# Altium project CM4 IO_V1.10.PrjPcb (part 2 of 5)

## Sheet 07 Audio SPK.SchDoc: CM4 IO
size 297 x 209 mm; Page Create Date: March  8, 1995; Page Number: 7; Page Size: A4; Comment: radxa_1010; Page Count: 19; RevCode: V1.10; Doc: 07 Audio SPK; DsnPath: D:\WMS\黄工\[RC126]CM4_IO_V1.10\[RC126]_V1.10\CM4 IO_V1.10.DSN; SchematicName: CM4 IO V1.10; PageName: 07 Audio SPK; PageSize: A4; TopSchematic: True
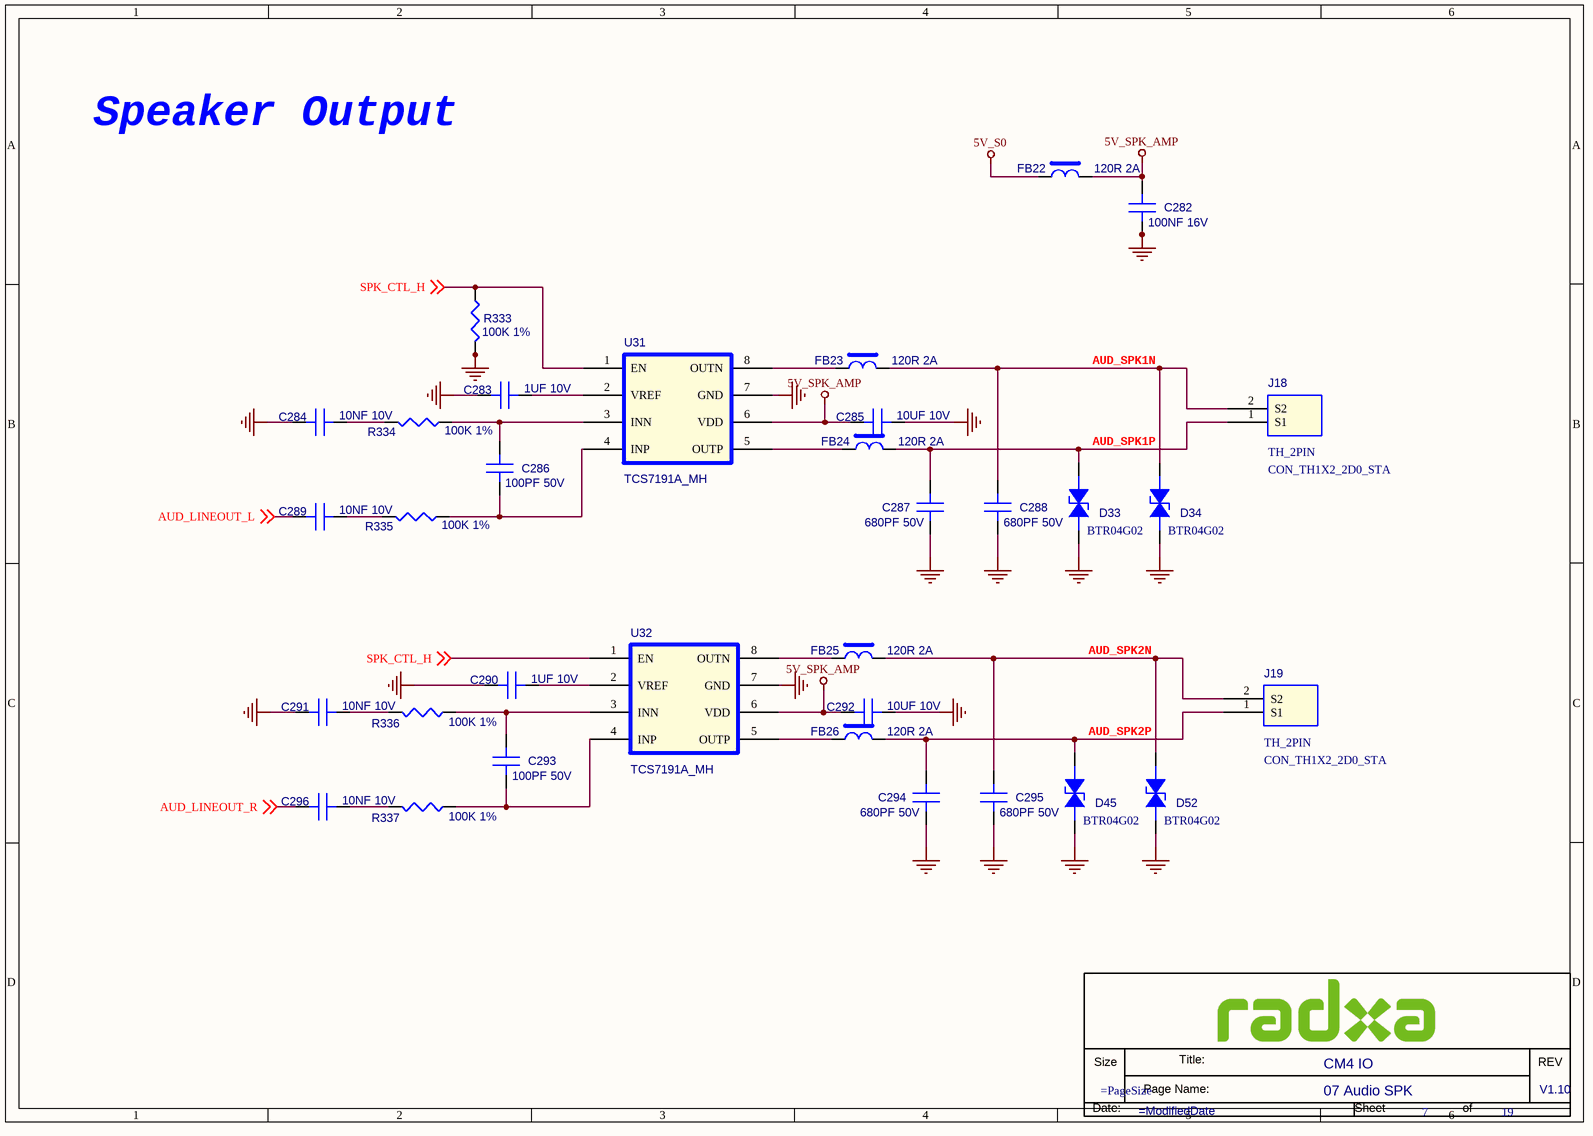
[diagram p5: 07 Audio SPK.SchDoc]

### Parts
(Parts that share a designator on the sheet are numbered #1, #2 ... from top to bottom, then left to right.)
*#6  Doc: 07 Audio SPK  RevCode: V1.10  Title: CM4 IO  Page Number: 7  Page Count: 19  (hidden comment: radxa_1010)  (graphical)
C282  100NF 16V  [C0201]
C283  1UF 10V  [C0201]
C284  10NF 10V  [C0201]
C285  10UF 10V  [C0603]
C286  100PF 50V  [C0201]
C287  680PF 50V  [C0201]
C288  680PF 50V  [C0201]
C289  10NF 10V  [C0201]
C290  1UF 10V  [C0201]
C291  10NF 10V  [C0201]
C292  10UF 10V  [C0603]
C293  100PF 50V  [C0201]
C294  680PF 50V  [C0201]
C295  680PF 50V  [C0201]
C296  10NF 10V  [C0201]
D33  BTR04G02  [DFN1006-2L]
D34  BTR04G02  [DFN1006-2L]
D45  BTR04G02  [DFN1006-2L]
D52  BTR04G02  [DFN1006-2L]
FB22  120R 2A  [FB0402]
FB23  120R 2A  [FB0402]
FB24  120R 2A  [FB0402]
FB25  120R 2A  [FB0402]
FB26  120R 2A  [FB0402]
J18  TH_2PIN  PCB Footprint: CON_TH1X2_2D0_STA  [CON_TH1X2_2D54_STA]
J19  TH_2PIN  PCB Footprint: CON_TH1X2_2D0_STA  [CON_TH1X2_2D54_STA]
R333  100K 1%  [R0402]
R334  100K 1%  [R0402]
R335  100K 1%  [R0402]
R336  100K 1%  [R0402]
R337  100K 1%  [R0402]
U31  TCS7191A_MH  [MSOP8_0D65_5D0]
U32  TCS7191A_MH  [MSOP8_0D65_5D0]

### Nets
5V_S0: FB22.1
5V_SPK_AMP: C282.1(A) C285.1(A) C292.1(A) FB22.2 U31.6(VDD) U32.6(VDD)
GND: C282.2(B) C283.1(A) C284.1(A) C285.2(B) C287.2(B) C288.2(B) C290.1(A) C291.1(A) C292.2(B) C294.2(B) C295.2(B) D33.1(ANODE) D34.1(ANODE) D45.1(ANODE) D52.1(ANODE) R333.2 U31.7(GND) U32.7(GND)
AUD_LINEOUT_L: C289.1(A) ; off-sheet AUD_LINEOUT_L
AUD_LINEOUT_R: C296.1(A) ; off-sheet AUD_LINEOUT_R
AUD_SPK1N: C288.1(A) D34.2(CATHODE) FB23.2 J18.2(S2)
AUD_SPK1P: C287.1(A) D33.2(CATHODE) FB24.2 J18.1(S1)
AUD_SPK2N: C295.1(A) D52.2(CATHODE) FB25.2 J19.2(S2)
AUD_SPK2P: C294.1(A) D45.2(CATHODE) FB26.2 J19.1(S1)
SPK_CTL_H: R333.1 U31.1(EN) U32.1(EN) ; off-sheet SPK_CTL_H
NetC283_2: C283.2(B) U31.2(VREF)
NetC284_2: C284.2(B) R334.1
NetC286_1: C286.1(A) R334.2 U31.3(INN)
NetC286_2: C286.2(B) R335.2 U31.4(INP)
NetC289_2: C289.2(B) R335.1
NetC290_2: C290.2(B) U32.2(VREF)
NetC291_2: C291.2(B) R336.1
NetC293_1: C293.1(A) R336.2 U32.3(INN)
NetC293_2: C293.2(B) R337.2 U32.4(INP)
NetC296_2: C296.2(B) R337.1
NetFB23_1: FB23.1 U31.8(OUTN)
NetFB24_1: FB24.1 U31.5(OUTP)
NetFB25_1: FB25.1 U32.8(OUTN)
NetFB26_1: FB26.1 U32.5(OUTP)

### Notes on the sheet
- Speaker Output
- (in symbol radxa_1010) Size; Title:; REV; Page Name:; Date:; Sheet; of

### Library data of the parts
C282 = C: SMD  0201  100NF  16V  X5R  ±20%  ROHS; PARTS: 1; Part Reference: C282; Part Number: A1C01.00099; OriginalSymbolOrigin: (0,30); PKG_TYPE: CAP2-100-250; LEVEL: STD; PINSWAP: (A,B); Preferred: 6715f349cd0bc5; Value: 100NF 16V; Part Type: 陶瓷电容
C283 = C: SMD  0201  1UF  10V  X5R  ±20%  ROHS; PARTS: 1; Part Reference: C283; Part Number: A1C01.00081; OriginalSymbolOrigin: (0,30); PKG_TYPE: CAP2-100-250; LEVEL: STD; PINSWAP: (A,B); Value: 1UF 10V; Part Type: 陶瓷电容; PCB Footprint: C0201
C284 = C: SMD  0201  10NF  10V  X5R  ±20%  ROHS; PARTS: 1; Part Reference: C284; Part Number: A1C01.00095; OriginalSymbolOrigin: (0,30); PKG_TYPE: CAP2-100-250; LEVEL: STD; PINSWAP: (A,B); Value: 10NF 10V; Part Type: 陶瓷电容; PCB Footprint: C0201
C285 = C: SMD  0603  10UF  10V  X5R  ±20%  ROHS; PARTS: 1; Part Reference: C285; Part Number: A1C01.00075; OriginalSymbolOrigin: (0,30); PKG_TYPE: CAP2-100-250; LEVEL: STD; PINSWAP: (A,B); Value: 10UF 10V; Part Type: 陶瓷电容; PCB Footprint: C0603
C286 = C: SMD  0201  100PF  50V  NPO  ±5%  ROHS; PARTS: 1; Part Reference: C286; Part Number: A1C01.00382; OriginalSymbolOrigin: (0,30); PKG_TYPE: CAP2-100-250; LEVEL: STD; PINSWAP: (A,B); Value: 100PF 50V; Part Type: 陶瓷电容; PCB Footprint: C0201
C287 = C: SMD  0201  680PF  50V  X7R  ±10%  ROHS; PARTS: 1; Part Reference: C287; Part Number: A1C01.00071; OriginalSymbolOrigin: (0,30); PKG_TYPE: CAP2-100-250; LEVEL: STD; PINSWAP: (A,B); Value: 680PF 50V; Part Type: 陶瓷电容; PCB Footprint: C0201
C288 = C: SMD  0201  680PF  50V  X7R  ±10%  ROHS; PARTS: 1; Part Reference: C288; Part Number: A1C01.00071; OriginalSymbolOrigin: (0,30); PKG_TYPE: CAP2-100-250; LEVEL: STD; PINSWAP: (A,B); Value: 680PF 50V; Part Type: 陶瓷电容; PCB Footprint: C0201
C289 = C: SMD  0201  10NF  10V  X5R  ±20%  ROHS; PARTS: 1; Part Reference: C289; Part Number: A1C01.00095; OriginalSymbolOrigin: (0,30); PKG_TYPE: CAP2-100-250; LEVEL: STD; PINSWAP: (A,B); Value: 10NF 10V; Part Type: 陶瓷电容; PCB Footprint: C0201
C290 = C: SMD  0201  1UF  10V  X5R  ±20%  ROHS; PARTS: 1; Part Reference: C290; Part Number: A1C01.00081; OriginalSymbolOrigin: (0,30); PKG_TYPE: CAP2-100-250; LEVEL: STD; PINSWAP: (A,B); Value: 1UF 10V; Part Type: 陶瓷电容; PCB Footprint: C0201
C291 = C: SMD  0201  10NF  10V  X5R  ±20%  ROHS; PARTS: 1; Part Reference: C291; Part Number: A1C01.00095; OriginalSymbolOrigin: (0,30); PKG_TYPE: CAP2-100-250; LEVEL: STD; PINSWAP: (A,B); Value: 10NF 10V; Part Type: 陶瓷电容; PCB Footprint: C0201
C292 = C: SMD  0603  10UF  10V  X5R  ±20%  ROHS; PARTS: 1; Part Reference: C292; Part Number: A1C01.00075; OriginalSymbolOrigin: (0,30); PKG_TYPE: CAP2-100-250; LEVEL: STD; PINSWAP: (A,B); Value: 10UF 10V; Part Type: 陶瓷电容; PCB Footprint: C0603
C293 = C: SMD  0201  100PF  50V  NPO  ±5%  ROHS; PARTS: 1; Part Reference: C293; Part Number: A1C01.00382; OriginalSymbolOrigin: (0,30); PKG_TYPE: CAP2-100-250; LEVEL: STD; PINSWAP: (A,B); Value: 100PF 50V; Part Type: 陶瓷电容; PCB Footprint: C0201
C294 = C: SMD  0201  680PF  50V  X7R  ±10%  ROHS; PARTS: 1; Part Reference: C294; Part Number: A1C01.00071; OriginalSymbolOrigin: (0,30); PKG_TYPE: CAP2-100-250; LEVEL: STD; PINSWAP: (A,B); Value: 680PF 50V; Part Type: 陶瓷电容; PCB Footprint: C0201
C295 = C: SMD  0201  680PF  50V  X7R  ±10%  ROHS; PARTS: 1; Part Reference: C295; Part Number: A1C01.00071; OriginalSymbolOrigin: (0,30); PKG_TYPE: CAP2-100-250; LEVEL: STD; PINSWAP: (A,B); Value: 680PF 50V; Part Type: 陶瓷电容; PCB Footprint: C0201
C296 = C: SMD  0201  10NF  10V  X5R  ±20%  ROHS; PARTS: 1; Part Reference: C296; Part Number: A1C01.00095; OriginalSymbolOrigin: (0,30); PKG_TYPE: CAP2-100-250; LEVEL: STD; PINSWAP: (A,B); Value: 10NF 10V; Part Type: 陶瓷电容; PCB Footprint: C0201
D33 = ESD: SMD  编带  0402  BTR04G02  B-tron  ROHS; Part Reference: D33; Part Number: A1D02.00002; Parameter: ESD-台舟 ESD5341N-封装 esd0402; ID: DE-E0004; Temp Coeff: -50℃ ~ +125℃; PCB Footprint: ESD_D0402; Value: BTR04G02; Part Type: 二极管-ESD管-桥堆-TVS管
D34 = ESD: SMD  编带  0402  BTR04G02  B-tron  ROHS; Part Reference: D34; Part Number: A1D02.00002; Parameter: ESD-台舟 ESD5341N-封装 esd0402; ID: DE-E0004; Temp Coeff: -50℃ ~ +125℃; PCB Footprint: ESD_D0402; Value: BTR04G02; Part Type: 二极管-ESD管-桥堆-TVS管
D45 = ESD: SMD  编带  0402  BTR04G02  B-tron  ROHS; Part Reference: D45; Part Number: A1D02.00002; Parameter: ESD-台舟 ESD5341N-封装 esd0402; ID: DE-E0004; Temp Coeff: -50℃ ~ +125℃; PCB Footprint: ESD_D0402; Value: BTR04G02; Part Type: 二极管-ESD管-桥堆-TVS管
D52 = ESD: SMD  编带  0402  BTR04G02  B-tron  ROHS; Part Reference: D52; Part Number: A1D02.00002; Parameter: ESD-台舟 ESD5341N-封装 esd0402; ID: DE-E0004; Temp Coeff: -50℃ ~ +125℃; PCB Footprint: ESD_D0402; Value: BTR04G02; Part Type: 二极管-ESD管-桥堆-TVS管
FB22 = BEAD: SMD  0402  FB120R  2A  ±25%  ROHS; Part Reference: FB22; Part Number: A1L09.00004; PCB Footprint: FB0402; Value: 120R 2A; Part Type: 贴片磁珠
FB23 = BEAD: SMD  0402  FB120R  2A  ±25%  ROHS; Part Reference: FB23; Part Number: A1L09.00004; PCB Footprint: FB0402; Value: 120R 2A; Part Type: 贴片磁珠
FB24 = BEAD: SMD  0402  FB120R  2A  ±25%  ROHS; Part Reference: FB24; Part Number: A1L09.00004; PCB Footprint: FB0402; Value: 120R 2A; Part Type: 贴片磁珠
FB25 = BEAD: SMD  0402  FB120R  2A  ±25%  ROHS; Part Reference: FB25; Part Number: A1L09.00004; PCB Footprint: FB0402; Value: 120R 2A; Part Type: 贴片磁珠
FB26 = BEAD: SMD  0402  FB120R  2A  ±25%  ROHS; Part Reference: FB26; Part Number: A1L09.00004; PCB Footprint: FB0402; Value: 120R 2A; Part Type: 贴片磁珠
J18 = TH_2PIN: DIP  排针座  1*2PIN  180度  2.0mm脚距  中间朔高2.0mm  针长一端3.9mm  另一端2.8mm  方针  黑色  ZX-PZ2.0-1-2PZZ  Megastar(兆星)  ROHS; Part Reference: J18; Part Number: A1J02.00089; Temp Coeff: -40℃ to +105℃; Preferred: 6715f352cd0bcd; Value: TH_2PIN; Part Type: 排座
J19 = TH_2PIN: DIP  排针座  1*2PIN  180度  2.0mm脚距  中间朔高2.0mm  针长一端3.9mm  另一端2.8mm  方针  黑色  ZX-PZ2.0-1-2PZZ  Megastar(兆星)  ROHS; Part Reference: J19; Part Number: A1J02.00089; Temp Coeff: -40℃ to +105℃; Preferred: 6715f352cd0bcd; Value: TH_2PIN; Part Type: 排座
R333 = R: SMD  0201  100K  1/20W  ±1%  ROHS; Part Reference: R333; Part Number: A1R01.00165; Preferred: 6715f349cd0bc5; Value: 100K 1%; Part Type: 贴片电阻
R334 = R: SMD  0201  100K  1/20W  ±1%  ROHS; Part Reference: R334; Part Number: A1R01.00165; Preferred: 6715f349cd0bc5; Value: 100K 1%; Part Type: 贴片电阻
R335 = R: SMD  0201  100K  1/20W  ±1%  ROHS; Part Reference: R335; Part Number: A1R01.00165; Preferred: 6715f349cd0bc5; Value: 100K 1%; Part Type: 贴片电阻
R336 = R: SMD  0201  100K  1/20W  ±1%  ROHS; Part Reference: R336; Part Number: A1R01.00165; Preferred: 6715f349cd0bc5; Value: 100K 1%; Part Type: 贴片电阻
R337 = R: SMD  0201  100K  1/20W  ±1%  ROHS; Part Reference: R337; Part Number: A1R01.00165; Preferred: 6715f349cd0bc5; Value: 100K 1%; Part Type: 贴片电阻
U31 = TCS7191A_MH: SMD  音频功率放大器  TCS7191A_MH  MSOP-8  TCS(汤诚)  ROHS; Part Reference: U31; Part Number: A1I01.00891; Preferred: 6715f349cd0bc5; Temp Coeff: -40℃ to +85℃; PCB Footprint: MSOP8_0D65_5D0; Value: TCS7191A_MH; Part Type: 集成电路/模块
U32 = TCS7191A_MH: SMD  音频功率放大器  TCS7191A_MH  MSOP-8  TCS(汤诚)  ROHS; Part Reference: U32; Part Number: A1I01.00891; Preferred: 6715f349cd0bc5; Temp Coeff: -40℃ to +85℃; PCB Footprint: MSOP8_0D65_5D0; Value: TCS7191A_MH; Part Type: 集成电路/模块
*#6 = radxa_1010: Page Create Date: March  8, 1995; Page Size: =PageSize; Page Modify Date: =ModifiedDate

## Sheet 08 VCC-Connetor.SchDoc: CM4 IO
size 420 x 297 mm; Page Create Date: March  8, 1995; Page Number: 8; Page Size: A3; Comment: radxa_1010; Page Count: 19; RevCode: V1.10; Doc: 08 VCC-Connetor; DsnPath: D:\WMS\黄工\[RC126]CM4_IO_V1.10\[RC126]_V1.10\CM4 IO_V1.10.DSN; SchematicName: CM4 IO V1.10; PageName: 08 VCC-Connetor; PageSize: A3; TopSchematic: True
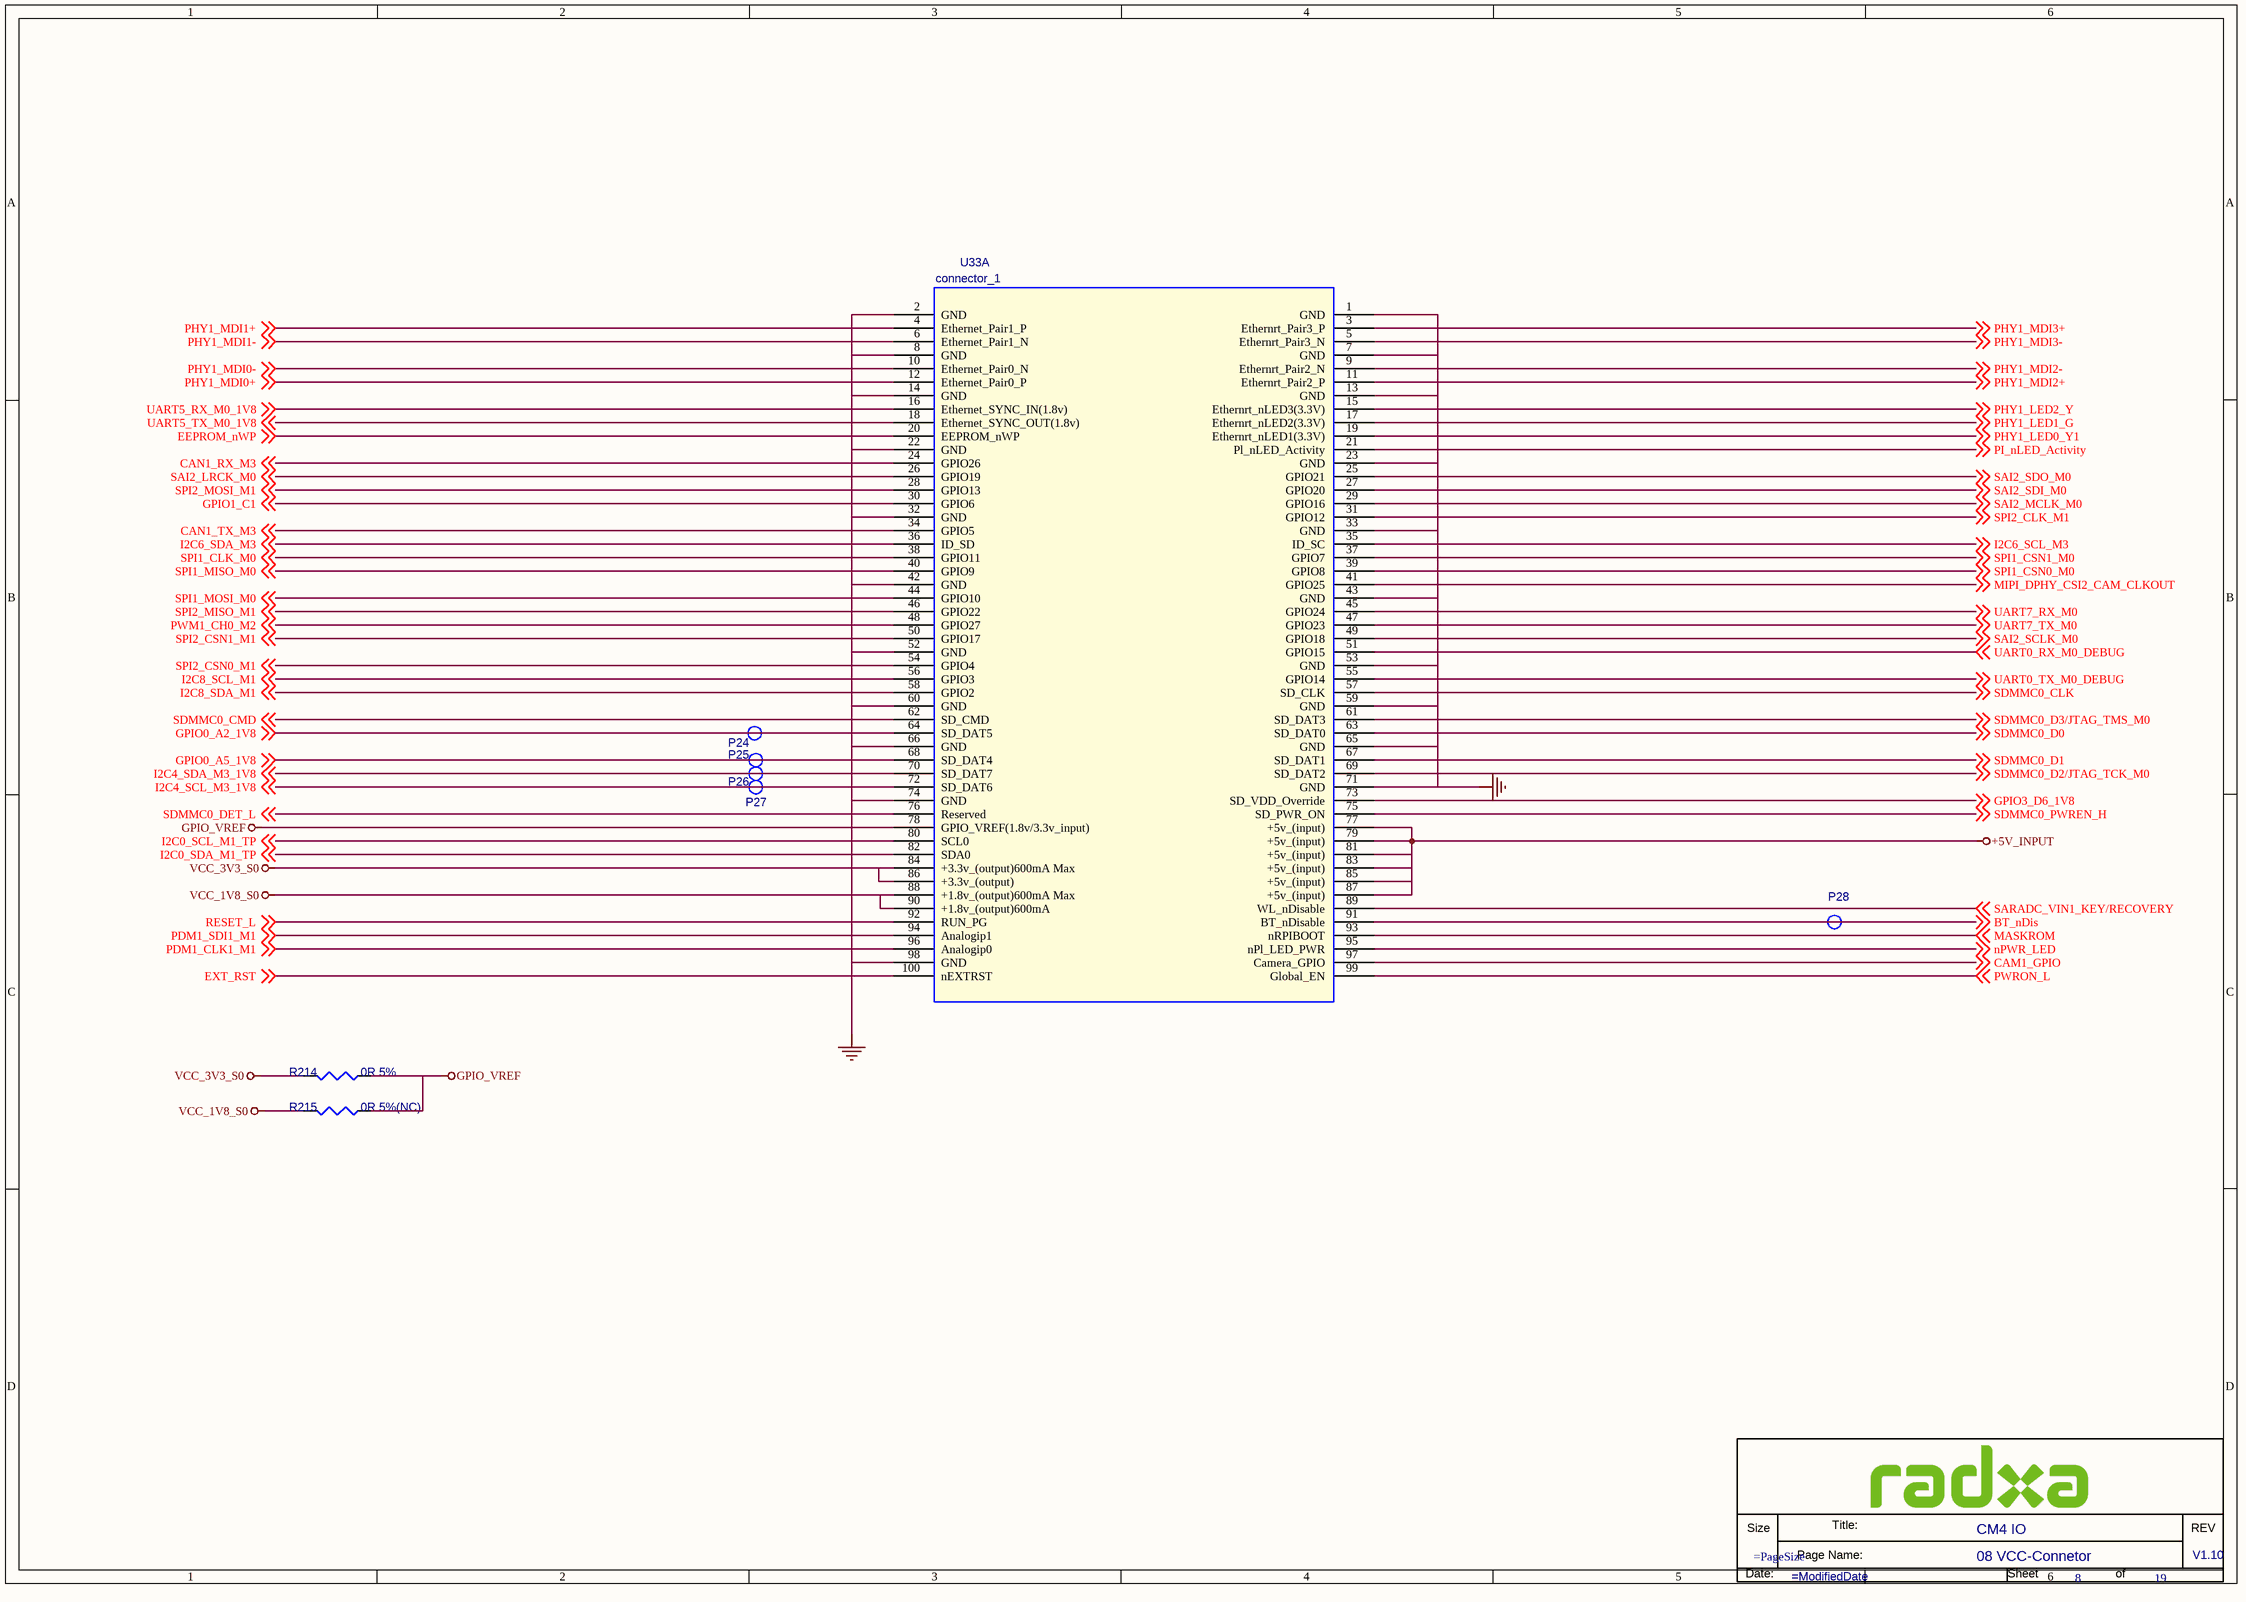
[diagram p6: 08 VCC-Connetor.SchDoc]

### Parts
(Parts that share a designator on the sheet are numbered #1, #2 ... from top to bottom, then left to right.)
*#7  Doc: 08 VCC-Connetor  RevCode: V1.10  Title: CM4 IO  Page Number: 8  Page Count: 19  (hidden comment: radxa_1010)  (graphical)
P24  TEST  [TEST]  (value not drawn)
P25  TEST  [TEST]  (value not drawn)
P26  TEST  [TEST]  (value not drawn)
P27  TEST  [TEST]  (value not drawn)
P28  TEST  [TEST]  (value not drawn)
R214  0R 5%  [R0402]
R215  0R 5%(NC)  [R0402]
U33  connector_1  [BTB_SMD100X2_0D4_STA]  (part A of 2)

### Nets
+5V_INPUT: U33.77(+5v_(input)) U33.79(+5v_(input)) U33.81(+5v_(input)) U33.83(+5v_(input)) U33.85(+5v_(input)) U33.87(+5v_(input))
GND: U33.1(GND) U33.2(GND) U33.7(GND) U33.8(GND) U33.13(GND) U33.14(GND) U33.22(GND) U33.23(GND) U33.32(GND) U33.33(GND) U33.42(GND) U33.43(GND) U33.52(GND) U33.53(GND) U33.59(GND) U33.60(GND) U33.65(GND) U33.66(GND) U33.71(GND) U33.74(GND) U33.98(GND)
GPIO_VREF: R214.1 R215.1 U33.78(GPIO_VREF(1.8v/3.3v_input))
VCC_1V8_S0: R215.2 U33.88(+1.8v_(output)600mA_Max) U33.90(+1.8v_(output)600mA)
VCC_3V3_S0: R214.2 U33.84(+3.3v_(output)600mA_Max) U33.86(+3.3v_(output))
BT_nDis: P28.1 U33.91(BT_nDisable) ; off-sheet BT_nDis
CAM1_GPIO: U33.97(Camera_GPIO) ; off-sheet CAM1_GPIO
CAN1_RX_M3: U33.24(GPIO26) ; off-sheet CAN1_RX_M3
CAN1_TX_M3: U33.34(GPIO5) ; off-sheet CAN1_TX_M3
EEPROM_nWP: U33.20(EEPROM_nWP) ; off-sheet EEPROM_nWP
EXT_RST: U33.100(nEXTRST) ; off-sheet EXT_RST
GPIO0_A2_1V8: P24.1 U33.64(SD_DAT5) ; off-sheet GPIO0_A2_1V8
GPIO0_A5_1V8: P25.1 U33.68(SD_DAT4) ; off-sheet GPIO0_A5_1V8
GPIO1_C1: U33.30(GPIO6) ; off-sheet GPIO1_C1
GPIO3_D6_1V8: U33.73(SD_VDD_Override) ; off-sheet GPIO3_D6_1V8
I2C0_SCL_M1_TP: U33.80(SCL0) ; off-sheet I2C0_SCL_M1_TP
I2C0_SDA_M1_TP: U33.82(SDA0) ; off-sheet I2C0_SDA_M1_TP
I2C4_SCL_M3_1V8: P27.1 U33.72(SD_DAT6) ; off-sheet I2C4_SCL_M3_1V8
I2C4_SDA_M3_1V8: P26.1 U33.70(SD_DAT7) ; off-sheet I2C4_SDA_M3_1V8
I2C6_SCL_M3: U33.35(ID_SC) ; off-sheet I2C6_SCL_M3
I2C6_SDA_M3: U33.36(ID_SD) ; off-sheet I2C6_SDA_M3
I2C8_SCL_M1: U33.56(GPIO3) ; off-sheet I2C8_SCL_M1
I2C8_SDA_M1: U33.58(GPIO2) ; off-sheet I2C8_SDA_M1
MASKROM: U33.93(nRPIBOOT) ; off-sheet MASKROM
MIPI_DPHY_CSI2_CAM_CLKOUT: U33.41(GPIO25) ; off-sheet MIPI_DPHY_CSI2_CAM_CLKOUT
nPWR_LED: U33.95(nPl_LED_PWR) ; off-sheet nPWR_LED
PDM1_CLK1_M1: U33.96(Analogip0) ; off-sheet PDM1_CLK1_M1
PDM1_SDI1_M1: U33.94(Analogip1) ; off-sheet PDM1_SDI1_M1
PHY1_LED0_Y1: U33.19(Ethernrt_nLED1(3.3V)) ; off-sheet PHY1_LED0_Y1
PHY1_LED1_G: U33.17(Ethernrt_nLED2(3.3V)) ; off-sheet PHY1_LED1_G
PHY1_LED2_Y: U33.15(Ethernrt_nLED3(3.3V)) ; off-sheet PHY1_LED2_Y
PHY1_MDI0+: U33.12(Ethernet_Pair0_P) ; off-sheet PHY1_MDI0+
PHY1_MDI0-: U33.10(Ethernet_Pair0_N) ; off-sheet PHY1_MDI0-
PHY1_MDI1+: U33.4(Ethernet_Pair1_P) ; off-sheet PHY1_MDI1+
PHY1_MDI1-: U33.6(Ethernet_Pair1_N) ; off-sheet PHY1_MDI1-
PHY1_MDI2+: U33.11(Ethernrt_Pair2_P) ; off-sheet PHY1_MDI2+
PHY1_MDI2-: U33.9(Ethernrt_Pair2_N) ; off-sheet PHY1_MDI2-
PHY1_MDI3+: U33.3(Ethernrt_Pair3_P) ; off-sheet PHY1_MDI3+
PHY1_MDI3-: U33.5(Ethernrt_Pair3_N) ; off-sheet PHY1_MDI3-
PI_nLED_Activity: U33.21(Pl_nLED_Activity) ; off-sheet PI_nLED_Activity
PWM1_CH0_M2: U33.48(GPIO27) ; off-sheet PWM1_CH0_M2
PWRON_L: U33.99(Global_EN) ; off-sheet PWRON_L
RESET_L: U33.92(RUN_PG) ; off-sheet RESET_L
SAI2_LRCK_M0: U33.26(GPIO19) ; off-sheet SAI2_LRCK_M0
SAI2_MCLK_M0: U33.29(GPIO16) ; off-sheet SAI2_MCLK_M0
SAI2_SCLK_M0: U33.49(GPIO18) ; off-sheet SAI2_SCLK_M0
SAI2_SDI_M0: U33.27(GPIO20) ; off-sheet SAI2_SDI_M0
SAI2_SDO_M0: U33.25(GPIO21) ; off-sheet SAI2_SDO_M0
SARADC_VIN1_KEY/RECOVERY: U33.89(WL_nDisable) ; off-sheet SARADC_VIN1_KEY/RECOVERY
SDMMC0_CLK: U33.57(SD_CLK) ; off-sheet SDMMC0_CLK
SDMMC0_CMD: U33.62(SD_CMD) ; off-sheet SDMMC0_CMD
SDMMC0_D0: U33.63(SD_DAT0) ; off-sheet SDMMC0_D0
SDMMC0_D1: U33.67(SD_DAT1) ; off-sheet SDMMC0_D1
SDMMC0_D2/JTAG_TCK_M0: U33.69(SD_DAT2) ; off-sheet SDMMC0_D2/JTAG_TCK_M0
SDMMC0_D3/JTAG_TMS_M0: U33.61(SD_DAT3) ; off-sheet SDMMC0_D3/JTAG_TMS_M0
SDMMC0_DET_L: U33.76(Reserved) ; off-sheet SDMMC0_DET_L
SDMMC0_PWREN_H: U33.75(SD_PWR_ON) ; off-sheet SDMMC0_PWREN_H
SPI1_CLK_M0: U33.38(GPIO11) ; off-sheet SPI1_CLK_M0
SPI1_CSN0_M0: U33.39(GPIO8) ; off-sheet SPI1_CSN0_M0
SPI1_CSN1_M0: U33.37(GPIO7) ; off-sheet SPI1_CSN1_M0
SPI1_MISO_M0: U33.40(GPIO9) ; off-sheet SPI1_MISO_M0
SPI1_MOSI_M0: U33.44(GPIO10) ; off-sheet SPI1_MOSI_M0
SPI2_CLK_M1: U33.31(GPIO12) ; off-sheet SPI2_CLK_M1
SPI2_CSN0_M1: U33.54(GPIO4) ; off-sheet SPI2_CSN0_M1
SPI2_CSN1_M1: U33.50(GPIO17) ; off-sheet SPI2_CSN1_M1
SPI2_MISO_M1: U33.46(GPIO22) ; off-sheet SPI2_MISO_M1
SPI2_MOSI_M1: U33.28(GPIO13) ; off-sheet SPI2_MOSI_M1
UART0_RX_M0_DEBUG: U33.51(GPIO15) ; off-sheet UART0_RX_M0_DEBUG
UART0_TX_M0_DEBUG: U33.55(GPIO14) ; off-sheet UART0_TX_M0_DEBUG
UART5_RX_M0_1V8: U33.16(Ethernet_SYNC_IN(1.8v)) ; off-sheet UART5_RX_M0_1V8
UART5_TX_M0_1V8: U33.18(Ethernet_SYNC_OUT(1.8v)) ; off-sheet UART5_TX_M0_1V8
UART7_RX_M0: U33.45(GPIO24) ; off-sheet UART7_RX_M0
UART7_TX_M0: U33.47(GPIO23) ; off-sheet UART7_TX_M0

### Notes on the sheet
- (in symbol radxa_1010) Size; Title:; REV; Page Name:; Date:; Sheet; of

### Library data of the parts
P24 = TESTPOINT1: Part Reference: P24; PCB Footprint: TP_0R70; Value: TEST
P25 = TESTPOINT1: Part Reference: P25; PCB Footprint: TP_0R70; Value: TEST
P26 = TESTPOINT1: Part Reference: P26; PCB Footprint: TP_0R70; Value: TEST
P27 = TESTPOINT1: Part Reference: P27; PCB Footprint: TP_0R70; Value: TEST
P28 = TESTPOINT1: Part Reference: P28; PCB Footprint: TP_0R70; Value: TEST
R214 = R: SMD  0201  0R  1/20W  ±5%  ROHS; Part Reference: R214; Part Number: A1R01.00027; PCB Footprint: R0201; Preferred: 6715f349cd0bc5; Temp Coeff: -55℃ to +125℃; Value: 0R 5%; Part Type: 贴片电阻
R215 = R: SMD  0201  0R  1/20W  ±5%  ROHS; Part Reference: R215; Part Number: A1R01.00027; PCB Footprint: R0201; Temp Coeff: -55℃ to +125℃; Preferred: 6715f349cd0bc5; Value: 0R 5%(NC); Part Type: 贴片电阻
U33 = HETER_4: Part Reference: U33; Value: connector_1; PCB Footprint: BTB_SMD100X2_0D4_STA
*#7 = radxa_1010: Page Create Date: March  8, 1995; Page Size: =PageSize; Page Modify Date: =ModifiedDate

## Sheet 09 High Speed-Connector.SchDoc: CM4 IO
size 420 x 297 mm; Page Create Date: March  8, 1995; Page Number: 9; Page Size: A3; Comment: radxa_1010; Page Count: 19; RevCode: V1.10; Doc: 09 High Speed-Connector; DsnPath: D:\WMS\黄工\[RC126]CM4_IO_V1.10\[RC126]_V1.10\CM4 IO_V1.10.DSN; SchematicName: CM4 IO V1.10; PageName: 09 High Speed-Connector; PageSize: A3; TopSchematic: True
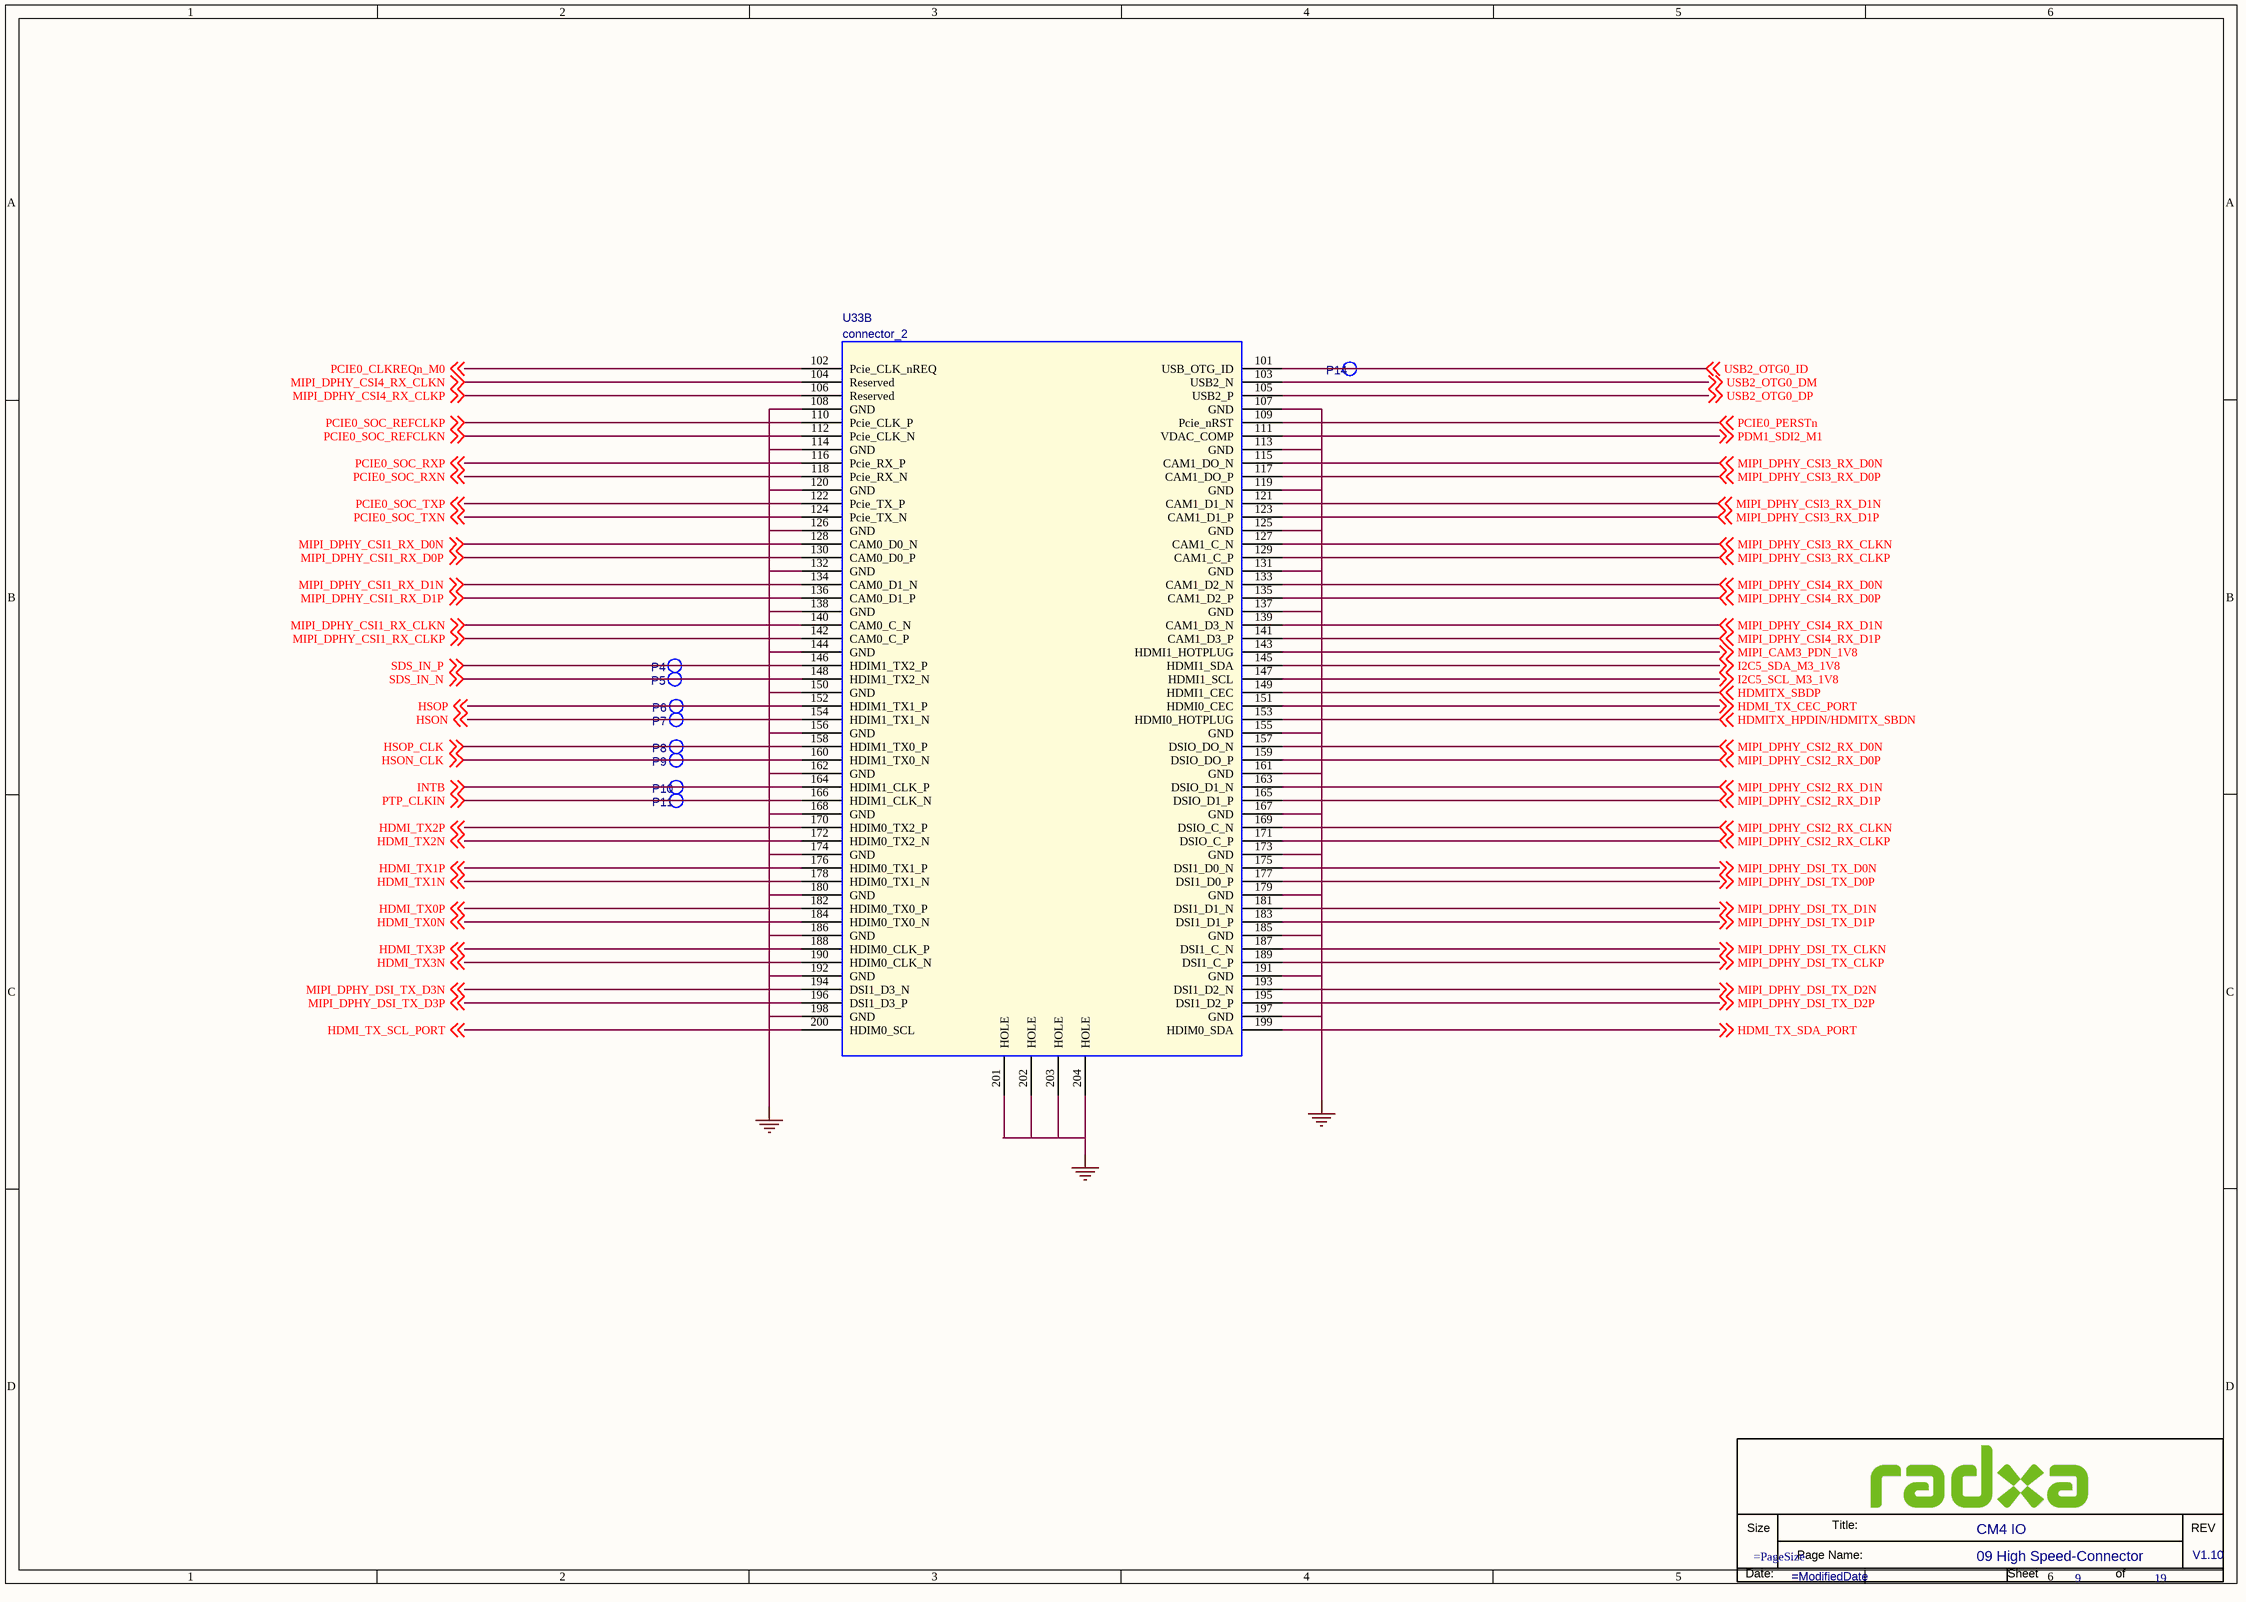
[diagram p7: 09 High Speed-Connector.SchDoc]

### Parts
(Parts that share a designator on the sheet are numbered #1, #2 ... from top to bottom, then left to right.)
*#8  Doc: 09 High Speed-Connector  RevCode: V1.10  Title: CM4 IO  Page Number: 9  Page Count: 19  (hidden comment: radxa_1010)  (graphical)
P4  TEST  [TEST]  (value not drawn)
P5  TEST  [TEST]  (value not drawn)
P6  TEST  [TEST]  (value not drawn)
P7  TEST  [TEST]  (value not drawn)
P8  TEST  [TEST]  (value not drawn)
P9  TEST  [TEST]  (value not drawn)
P10  TEST  [TEST]  (value not drawn)
P11  TEST  [TEST]  (value not drawn)
P14  TEST  [TEST]  (value not drawn)
U33  connector_2  [BTB_SMD100X2_0D4_STA]  (part B of 2)

### Nets
GND: U33.107(GND) U33.108(GND) U33.113(GND) U33.114(GND) U33.119(GND) U33.120(GND) U33.125(GND) U33.126(GND) U33.131(GND) U33.132(GND) U33.137(GND) U33.138(GND) U33.144(GND) U33.150(GND) U33.155(GND) U33.156(GND) U33.161(GND) U33.162(GND) U33.167(GND) U33.168(GND) U33.173(GND) U33.174(GND) U33.179(GND) U33.180(GND) U33.185(GND) U33.186(GND) U33.191(GND) U33.192(GND) U33.197(GND) U33.198(GND) U33.201(HOLE) U33.202(HOLE) U33.203(HOLE) U33.204(HOLE)
HDMI_TX0N: U33.184(HDIM0_TX0_N) ; off-sheet HDMI_TX0N
HDMI_TX0P: U33.182(HDIM0_TX0_P) ; off-sheet HDMI_TX0P
HDMI_TX1N: U33.178(HDIM0_TX1_N) ; off-sheet HDMI_TX1N
HDMI_TX1P: U33.176(HDIM0_TX1_P) ; off-sheet HDMI_TX1P
HDMI_TX2N: U33.172(HDIM0_TX2_N) ; off-sheet HDMI_TX2N
HDMI_TX2P: U33.170(HDIM0_TX2_P) ; off-sheet HDMI_TX2P
HDMI_TX3N: U33.190(HDIM0_CLK_N) ; off-sheet HDMI_TX3N
HDMI_TX3P: U33.188(HDIM0_CLK_P) ; off-sheet HDMI_TX3P
HDMI_TX_CEC_PORT: U33.151(HDMI0_CEC) ; off-sheet HDMI_TX_CEC_PORT
HDMI_TX_SCL_PORT: U33.200(HDIM0_SCL) ; off-sheet HDMI_TX_SCL_PORT
HDMI_TX_SDA_PORT: U33.199(HDIM0_SDA) ; off-sheet HDMI_TX_SDA_PORT
HDMITX_HPDIN/HDMITX_SBDN: U33.153(HDMI0_HOTPLUG) ; off-sheet HDMITX_HPDIN/HDMITX_SBDN
HDMITX_SBDP: U33.149(HDMI1_CEC) ; off-sheet HDMITX_SBDP
HSON: P7.1 U33.154(HDIM1_TX1_N) ; off-sheet HSON
HSON_CLK: P9.1 U33.160(HDIM1_TX0_N) ; off-sheet HSON_CLK
HSOP: P6.1 U33.152(HDIM1_TX1_P) ; off-sheet HSOP
HSOP_CLK: P8.1 U33.158(HDIM1_TX0_P) ; off-sheet HSOP_CLK
I2C5_SCL_M3_1V8: U33.147(HDMI1_SCL) ; off-sheet I2C5_SCL_M3_1V8
I2C5_SDA_M3_1V8: U33.145(HDMI1_SDA) ; off-sheet I2C5_SDA_M3_1V8
INTB: P10.1 U33.164(HDIM1_CLK_P) ; off-sheet INTB
MIPI_CAM3_PDN_1V8: U33.143(HDMI1_HOTPLUG) ; off-sheet MIPI_CAM3_PDN_1V8
MIPI_DPHY_CSI1_RX_CLKN: U33.140(CAM0_C_N) ; off-sheet MIPI_DPHY_CSI1_RX_CLKN
MIPI_DPHY_CSI1_RX_CLKP: U33.142(CAM0_C_P) ; off-sheet MIPI_DPHY_CSI1_RX_CLKP
MIPI_DPHY_CSI1_RX_D0N: U33.128(CAM0_D0_N) ; off-sheet MIPI_DPHY_CSI1_RX_D0N
MIPI_DPHY_CSI1_RX_D0P: U33.130(CAM0_D0_P) ; off-sheet MIPI_DPHY_CSI1_RX_D0P
MIPI_DPHY_CSI1_RX_D1N: U33.134(CAM0_D1_N) ; off-sheet MIPI_DPHY_CSI1_RX_D1N
MIPI_DPHY_CSI1_RX_D1P: U33.136(CAM0_D1_P) ; off-sheet MIPI_DPHY_CSI1_RX_D1P
MIPI_DPHY_CSI2_RX_CLKN: U33.169(DSIO_C_N) ; off-sheet MIPI_DPHY_CSI2_RX_CLKN
MIPI_DPHY_CSI2_RX_CLKP: U33.171(DSIO_C_P) ; off-sheet MIPI_DPHY_CSI2_RX_CLKP
MIPI_DPHY_CSI2_RX_D0N: U33.157(DSIO_DO_N) ; off-sheet MIPI_DPHY_CSI2_RX_D0N
MIPI_DPHY_CSI2_RX_D0P: U33.159(DSIO_DO_P) ; off-sheet MIPI_DPHY_CSI2_RX_D0P
MIPI_DPHY_CSI2_RX_D1N: U33.163(DSIO_D1_N) ; off-sheet MIPI_DPHY_CSI2_RX_D1N
MIPI_DPHY_CSI2_RX_D1P: U33.165(DSIO_D1_P) ; off-sheet MIPI_DPHY_CSI2_RX_D1P
MIPI_DPHY_CSI3_RX_CLKN: U33.127(CAM1_C_N) ; off-sheet MIPI_DPHY_CSI3_RX_CLKN
MIPI_DPHY_CSI3_RX_CLKP: U33.129(CAM1_C_P) ; off-sheet MIPI_DPHY_CSI3_RX_CLKP
MIPI_DPHY_CSI3_RX_D0N: U33.115(CAM1_DO_N) ; off-sheet MIPI_DPHY_CSI3_RX_D0N
MIPI_DPHY_CSI3_RX_D0P: U33.117(CAM1_DO_P) ; off-sheet MIPI_DPHY_CSI3_RX_D0P
MIPI_DPHY_CSI3_RX_D1N: U33.121(CAM1_D1_N) ; off-sheet MIPI_DPHY_CSI3_RX_D1N
MIPI_DPHY_CSI3_RX_D1P: U33.123(CAM1_D1_P) ; off-sheet MIPI_DPHY_CSI3_RX_D1P
MIPI_DPHY_CSI4_RX_CLKN: U33.104(Reserved) ; off-sheet MIPI_DPHY_CSI4_RX_CLKN
MIPI_DPHY_CSI4_RX_CLKP: U33.106(Reserved) ; off-sheet MIPI_DPHY_CSI4_RX_CLKP
MIPI_DPHY_CSI4_RX_D0N: U33.133(CAM1_D2_N) ; off-sheet MIPI_DPHY_CSI4_RX_D0N
MIPI_DPHY_CSI4_RX_D0P: U33.135(CAM1_D2_P) ; off-sheet MIPI_DPHY_CSI4_RX_D0P
MIPI_DPHY_CSI4_RX_D1N: U33.139(CAM1_D3_N) ; off-sheet MIPI_DPHY_CSI4_RX_D1N
MIPI_DPHY_CSI4_RX_D1P: U33.141(CAM1_D3_P) ; off-sheet MIPI_DPHY_CSI4_RX_D1P
MIPI_DPHY_DSI_TX_CLKN: U33.187(DSI1_C_N) ; off-sheet MIPI_DPHY_DSI_TX_CLKN
MIPI_DPHY_DSI_TX_CLKP: U33.189(DSI1_C_P) ; off-sheet MIPI_DPHY_DSI_TX_CLKP
MIPI_DPHY_DSI_TX_D0N: U33.175(DSI1_D0_N) ; off-sheet MIPI_DPHY_DSI_TX_D0N
MIPI_DPHY_DSI_TX_D0P: U33.177(DSI1_D0_P) ; off-sheet MIPI_DPHY_DSI_TX_D0P
MIPI_DPHY_DSI_TX_D1N: U33.181(DSI1_D1_N) ; off-sheet MIPI_DPHY_DSI_TX_D1N
MIPI_DPHY_DSI_TX_D1P: U33.183(DSI1_D1_P) ; off-sheet MIPI_DPHY_DSI_TX_D1P
MIPI_DPHY_DSI_TX_D2N: U33.193(DSI1_D2_N) ; off-sheet MIPI_DPHY_DSI_TX_D2N
MIPI_DPHY_DSI_TX_D2P: U33.195(DSI1_D2_P) ; off-sheet MIPI_DPHY_DSI_TX_D2P
MIPI_DPHY_DSI_TX_D3N: U33.194(DSI1_D3_N) ; off-sheet MIPI_DPHY_DSI_TX_D3N
MIPI_DPHY_DSI_TX_D3P: U33.196(DSI1_D3_P) ; off-sheet MIPI_DPHY_DSI_TX_D3P
PCIE0_CLKREQn_M0: U33.102(Pcie_CLK_nREQ) ; off-sheet PCIE0_CLKREQn_M0
PCIE0_PERSTn: U33.109(Pcie_nRST) ; off-sheet PCIE0_PERSTn
PCIE0_SOC_REFCLKN: U33.112(Pcie_CLK_N) ; off-sheet PCIE0_SOC_REFCLKN
PCIE0_SOC_REFCLKP: U33.110(Pcie_CLK_P) ; off-sheet PCIE0_SOC_REFCLKP
PCIE0_SOC_RXN: U33.118(Pcie_RX_N) ; off-sheet PCIE0_SOC_RXN
PCIE0_SOC_RXP: U33.116(Pcie_RX_P) ; off-sheet PCIE0_SOC_RXP
PCIE0_SOC_TXN: U33.124(Pcie_TX_N) ; off-sheet PCIE0_SOC_TXN
PCIE0_SOC_TXP: U33.122(Pcie_TX_P) ; off-sheet PCIE0_SOC_TXP
PDM1_SDI2_M1: U33.111(VDAC_COMP) ; off-sheet PDM1_SDI2_M1
PTP_CLKIN: P11.1 U33.166(HDIM1_CLK_N) ; off-sheet PTP_CLKIN
SDS_IN_N: P5.1 U33.148(HDIM1_TX2_N) ; off-sheet SDS_IN_N
SDS_IN_P: P4.1 U33.146(HDIM1_TX2_P) ; off-sheet SDS_IN_P
USB2_OTG0_DM: U33.103(USB2_N) ; off-sheet USB2_OTG0_DM
USB2_OTG0_DP: U33.105(USB2_P) ; off-sheet USB2_OTG0_DP
USB2_OTG0_ID: P14.1 U33.101(USB_OTG_ID) ; off-sheet USB2_OTG0_ID

### Notes on the sheet
- (in symbol radxa_1010) Size; Title:; REV; Page Name:; Date:; Sheet; of

### Library data of the parts
P4 = TESTPOINT1: Part Reference: P4; PCB Footprint: TP_0R70; Value: TEST
P5 = TESTPOINT1: Part Reference: P5; PCB Footprint: TP_0R70; Value: TEST
P6 = TESTPOINT1: Part Reference: P6; PCB Footprint: TP_0R70; Value: TEST
P7 = TESTPOINT1: Part Reference: P7; PCB Footprint: TP_0R70; Value: TEST
P8 = TESTPOINT1: Part Reference: P8; PCB Footprint: TP_0R70; Value: TEST
P9 = TESTPOINT1: Part Reference: P9; PCB Footprint: TP_0R70; Value: TEST
P10 = TESTPOINT1: Part Reference: P10; PCB Footprint: TP_0R70; Value: TEST
P11 = TESTPOINT1: Part Reference: P11; PCB Footprint: TP_0R70; Value: TEST
P14 = TESTPOINT1: Part Reference: P14; PCB Footprint: TP_0R70; Value: TEST
U33 = HETER_4: Part Reference: U33; Value: connector_2; PCB Footprint: BTB_SMD100X2_0D4_STA
*#8 = radxa_1010: Page Create Date: March  8, 1995; Page Size: =PageSize; Page Modify Date: =ModifiedDate

## Sheet 10 IO-Connector.SchDoc: CM4 IO
size 420 x 297 mm; Page Create Date: March  8, 1995; Page Number: 10; Page Size: A3; Comment: radxa_1010; Page Count: 19; RevCode: V1.10; Doc: 10 IO-Connector; DsnPath: D:\WMS\黄工\[RC126]CM4_IO_V1.10\[RC126]_V1.10\CM4 IO_V1.10.DSN; SchematicName: CM4 IO V1.10; PageName: 10 IO-Connector; PageSize: A3; TopSchematic: True
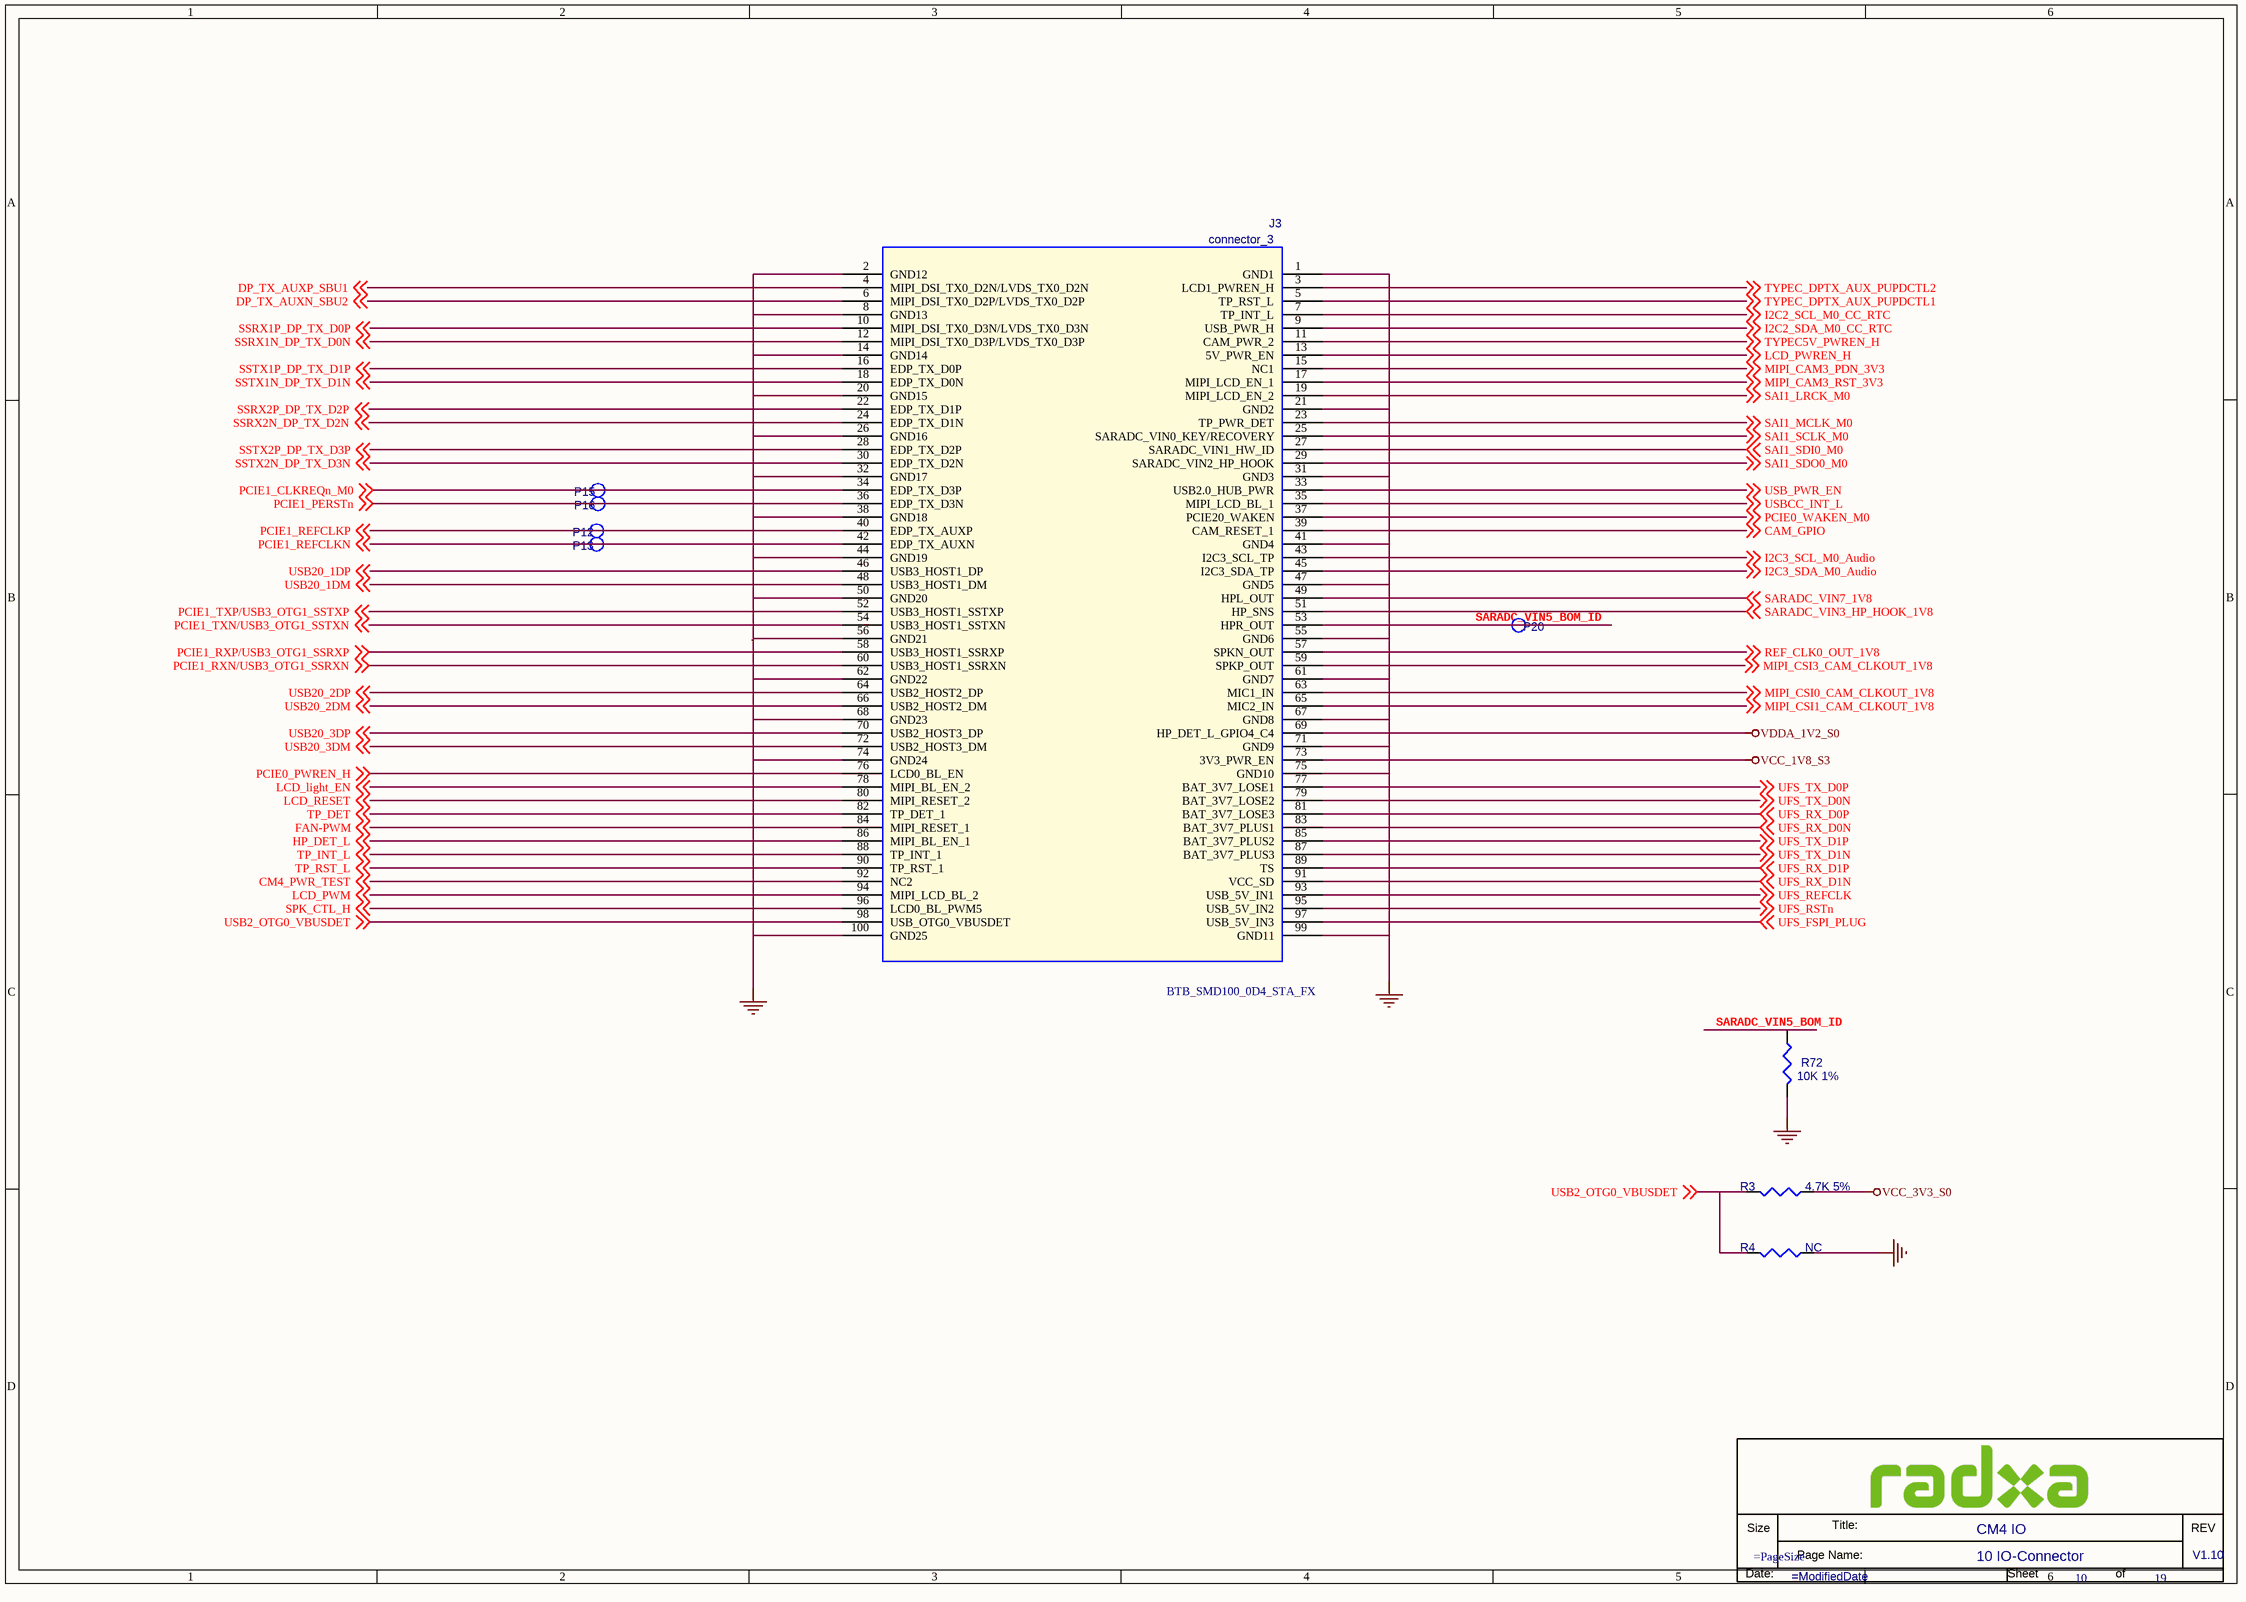
[diagram p8: 10 IO-Connector.SchDoc]

### Parts
(Parts that share a designator on the sheet are numbered #1, #2 ... from top to bottom, then left to right.)
*#9  Doc: 10 IO-Connector  RevCode: V1.10  Title: CM4 IO  Page Number: 10  Page Count: 19  (hidden comment: radxa_1010)  (graphical)
J3  connector_3  [BTB_SMD100_0D4_STA_FX]
P12  TEST  [TEST]  (value not drawn)
P13  TEST  [TEST]  (value not drawn)
P15  TEST  [TEST]  (value not drawn)
P16  TEST  [TEST]  (value not drawn)
P20  TEST  [TEST]  (value not drawn)
R3  4.7K 5%  [R0402]
R4  NC  [R0402]
R72  10K 1%  [R0402]

### Nets
GND: J3.1(GND1) J3.2(GND12) J3.8(GND13) J3.14(GND14) J3.20(GND15) J3.21(GND2) J3.26(GND16) J3.31(GND3) J3.32(GND17) J3.38(GND18) J3.41(GND4) J3.44(GND19) J3.47(GND5) J3.50(GND20) J3.55(GND6) J3.56(GND21) J3.61(GND7) J3.62(GND22) J3.67(GND8) J3.68(GND23) J3.71(GND9) J3.74(GND24) J3.75(GND10) J3.99(GND11) J3.100(GND25) R4.2 R72.2
VCC_1V8_S3: J3.73(3V3_PWR_EN)
VCC_3V3_S0: R3.2
VDDA_1V2_S0: J3.69(HP_DET_L_GPIO4_C4)
CAM_GPIO: J3.39(CAM_RESET_1) ; off-sheet CAM_GPIO
CM4_PWR_TEST: J3.92(NC2) ; off-sheet CM4_PWR_TEST
DP_TX_AUXN_SBU2: J3.6(MIPI_DSI_TX0_D2P/LVDS_TX0_D2P) ; off-sheet DP_TX_AUXN_SBU2
DP_TX_AUXP_SBU1: J3.4(MIPI_DSI_TX0_D2N/LVDS_TX0_D2N) ; off-sheet DP_TX_AUXP_SBU1
FAN-PWM: J3.84(MIPI_RESET_1) ; off-sheet FAN-PWM
HP_DET_L: J3.86(MIPI_BL_EN_1) ; off-sheet HP_DET_L
I2C2_SCL_M0_CC_RTC: J3.7(TP_INT_L) ; off-sheet I2C2_SCL_M0_CC_RTC
I2C2_SDA_M0_CC_RTC: J3.9(USB_PWR_H) ; off-sheet I2C2_SDA_M0_CC_RTC
I2C3_SCL_M0_Audio: J3.43(I2C3_SCL_TP) ; off-sheet I2C3_SCL_M0_Audio
I2C3_SDA_M0_Audio: J3.45(I2C3_SDA_TP) ; off-sheet I2C3_SDA_M0_Audio
LCD_light_EN: J3.78(MIPI_BL_EN_2) ; off-sheet LCD_light_EN
LCD_PWM: J3.94(MIPI_LCD_BL_2) ; off-sheet LCD_PWM
LCD_PWREN_H: J3.13(5V_PWR_EN) ; off-sheet LCD_PWREN_H
LCD_RESET: J3.80(MIPI_RESET_2) ; off-sheet LCD_RESET
MIPI_CAM3_PDN_3V3: J3.15(NC1) ; off-sheet MIPI_CAM3_PDN_3V3
MIPI_CAM3_RST_3V3: J3.17(MIPI_LCD_EN_1) ; off-sheet MIPI_CAM3_RST_3V3
MIPI_CSI0_CAM_CLKOUT_1V8: J3.63(MIC1_IN) ; off-sheet MIPI_CSI0_CAM_CLKOUT_1V8
MIPI_CSI1_CAM_CLKOUT_1V8: J3.65(MIC2_IN) ; off-sheet MIPI_CSI1_CAM_CLKOUT_1V8
MIPI_CSI3_CAM_CLKOUT_1V8: J3.59(SPKP_OUT) ; off-sheet MIPI_CSI3_CAM_CLKOUT_1V8
PCIE0_PWREN_H: J3.76(LCD0_BL_EN) ; off-sheet PCIE0_PWREN_H
PCIE0_WAKEN_M0: J3.37(PCIE20_WAKEN) ; off-sheet PCIE0_WAKEN_M0
PCIE1_CLKREQn_M0: J3.34(EDP_TX_D3P) P15.1 ; off-sheet PCIE1_CLKREQn_M0
PCIE1_PERSTn: J3.36(EDP_TX_D3N) P16.1 ; off-sheet PCIE1_PERSTn
PCIE1_REFCLKN: J3.42(EDP_TX_AUXN) P13.1 ; off-sheet PCIE1_REFCLKN
PCIE1_REFCLKP: J3.40(EDP_TX_AUXP) P12.1 ; off-sheet PCIE1_REFCLKP
PCIE1_RXN/USB3_OTG1_SSRXN: J3.60(USB3_HOST1_SSRXN) ; off-sheet PCIE1_RXN/USB3_OTG1_SSRXN
PCIE1_RXP/USB3_OTG1_SSRXP: J3.58(USB3_HOST1_SSRXP) ; off-sheet PCIE1_RXP/USB3_OTG1_SSRXP
PCIE1_TXN/USB3_OTG1_SSTXN: J3.54(USB3_HOST1_SSTXN) ; off-sheet PCIE1_TXN/USB3_OTG1_SSTXN
PCIE1_TXP/USB3_OTG1_SSTXP: J3.52(USB3_HOST1_SSTXP) ; off-sheet PCIE1_TXP/USB3_OTG1_SSTXP
REF_CLK0_OUT_1V8: J3.57(SPKN_OUT) ; off-sheet REF_CLK0_OUT_1V8
SAI1_LRCK_M0: J3.19(MIPI_LCD_EN_2) ; off-sheet SAI1_LRCK_M0
SAI1_MCLK_M0: J3.23(TP_PWR_DET) ; off-sheet SAI1_MCLK_M0
SAI1_SCLK_M0: J3.25(SARADC_VIN0_KEY/RECOVERY) ; off-sheet SAI1_SCLK_M0
SAI1_SDI0_M0: J3.27(SARADC_VIN1_HW_ID) ; off-sheet SAI1_SDI0_M0
SAI1_SDO0_M0: J3.29(SARADC_VIN2_HP_HOOK) ; off-sheet SAI1_SDO0_M0
SARADC_VIN3_HP_HOOK_1V8: J3.51(HP_SNS) ; off-sheet SARADC_VIN3_HP_HOOK_1V8
SARADC_VIN5_BOM_ID: J3.53(HPR_OUT) P20.1 R72.1
SARADC_VIN7_1V8: J3.49(HPL_OUT) ; off-sheet SARADC_VIN7_1V8
SPK_CTL_H: J3.96(LCD0_BL_PWM5) ; off-sheet SPK_CTL_H
SSRX1N_DP_TX_D0N: J3.12(MIPI_DSI_TX0_D3P/LVDS_TX0_D3P) ; off-sheet SSRX1N_DP_TX_D0N
SSRX1P_DP_TX_D0P: J3.10(MIPI_DSI_TX0_D3N/LVDS_TX0_D3N) ; off-sheet SSRX1P_DP_TX_D0P
SSRX2N_DP_TX_D2N: J3.24(EDP_TX_D1N) ; off-sheet SSRX2N_DP_TX_D2N
SSRX2P_DP_TX_D2P: J3.22(EDP_TX_D1P) ; off-sheet SSRX2P_DP_TX_D2P
SSTX1N_DP_TX_D1N: J3.18(EDP_TX_D0N) ; off-sheet SSTX1N_DP_TX_D1N
SSTX1P_DP_TX_D1P: J3.16(EDP_TX_D0P) ; off-sheet SSTX1P_DP_TX_D1P
SSTX2N_DP_TX_D3N: J3.30(EDP_TX_D2N) ; off-sheet SSTX2N_DP_TX_D3N
SSTX2P_DP_TX_D3P: J3.28(EDP_TX_D2P) ; off-sheet SSTX2P_DP_TX_D3P
TP_DET: J3.82(TP_DET_1) ; off-sheet TP_DET
TP_INT_L: J3.88(TP_INT_1) ; off-sheet TP_INT_L
TP_RST_L: J3.90(TP_RST_1) ; off-sheet TP_RST_L
TYPEC5V_PWREN_H: J3.11(CAM_PWR_2) ; off-sheet TYPEC5V_PWREN_H
TYPEC_DPTX_AUX_PUPDCTL1: J3.5(TP_RST_L) ; off-sheet TYPEC_DPTX_AUX_PUPDCTL1
TYPEC_DPTX_AUX_PUPDCTL2: J3.3(LCD1_PWREN_H) ; off-sheet TYPEC_DPTX_AUX_PUPDCTL2
UFS_FSPI_PLUG: J3.97(USB_5V_IN3) ; off-sheet UFS_FSPI_PLUG
UFS_REFCLK: J3.93(USB_5V_IN1) ; off-sheet UFS_REFCLK
UFS_RSTn: J3.95(USB_5V_IN2) ; off-sheet UFS_RSTn
UFS_RX_D0N: J3.83(BAT_3V7_PLUS1) ; off-sheet UFS_RX_D0N
UFS_RX_D0P: J3.81(BAT_3V7_LOSE3) ; off-sheet UFS_RX_D0P
UFS_RX_D1N: J3.91(VCC_SD) ; off-sheet UFS_RX_D1N
UFS_RX_D1P: J3.89(TS) ; off-sheet UFS_RX_D1P
UFS_TX_D0N: J3.79(BAT_3V7_LOSE2) ; off-sheet UFS_TX_D0N
UFS_TX_D0P: J3.77(BAT_3V7_LOSE1) ; off-sheet UFS_TX_D0P
UFS_TX_D1N: J3.87(BAT_3V7_PLUS3) ; off-sheet UFS_TX_D1N
UFS_TX_D1P: J3.85(BAT_3V7_PLUS2) ; off-sheet UFS_TX_D1P
USB2_OTG0_VBUSDET: J3.98(USB_OTG0_VBUSDET) R3.1 R4.1 ; off-sheet USB2_OTG0_VBUSDET
USB20_1DM: J3.48(USB3_HOST1_DM) ; off-sheet USB20_1DM
USB20_1DP: J3.46(USB3_HOST1_DP) ; off-sheet USB20_1DP
USB20_2DM: J3.66(USB2_HOST2_DM) ; off-sheet USB20_2DM
USB20_2DP: J3.64(USB2_HOST2_DP) ; off-sheet USB20_2DP
USB20_3DM: J3.72(USB2_HOST3_DM) ; off-sheet USB20_3DM
USB20_3DP: J3.70(USB2_HOST3_DP) ; off-sheet USB20_3DP
USB_PWR_EN: J3.33(USB2.0_HUB_PWR) ; off-sheet USB_PWR_EN
USBCC_INT_L: J3.35(MIPI_LCD_BL_1) ; off-sheet USBCC_INT_L

### Notes on the sheet
- (in symbol radxa_1010) Size; Title:; REV; Page Name:; Date:; Sheet; of

### Library data of the parts
J3 = BTB_0: SMD  公座  2*50PIN  180度  21.5*1.85*1.14mm  0.4mm脚距  黑色  DF40C-100DP-0.4V(51)  HRS(广濑)  ROHS; Part Reference: J3; Part Number: A1J01.00021; Temp Coeff: -35℃ to +85℃; Preferred: 6715f349cd0bc5; Value: connector_3; Part Type: 连接座; PCB Footprint: BTB_SMD100_0D4_STA_FX
P12 = TESTPOINT1: Part Reference: P12; PCB Footprint: TP_0R70; Value: TEST
P13 = TESTPOINT1: Part Reference: P13; PCB Footprint: TP_0R70; Value: TEST
P15 = TESTPOINT1: Part Reference: P15; PCB Footprint: TP_0R70; Value: TEST
P16 = TESTPOINT1: Part Reference: P16; PCB Footprint: TP_0R70; Value: TEST
P20 = TESTPOINT1: Part Reference: P20; PCB Footprint: TP_0R70; Value: TEST
R3 = R: SMD  0201  4.7K  1/20W  ±5%  ROHS; Part Reference: R3; Part Number: A1R01.00014; PCB Footprint: R0201; Temp Coeff: -55℃ to +125℃; Preferred: 6715f349cd0bc5; Value: 4.7K 5%; Part Type: 贴片电阻
R4 = R: SMD  0201  4.7K  1/20W  ±5%  ROHS; Part Reference: R4; Part Number: A1R01.00014; PCB Footprint: R0201; Temp Coeff: -55℃ to +125℃; Preferred: 6715f349cd0bc5; Value: NC; Part Type: 贴片电阻
R72 = R: SMD  0201  10K  1/20W  ±1%  ROHS; Part Reference: R72; Part Number: A1R01.00060; PCB Footprint: R0201; Temp Coeff: -55℃ to +125℃; Preferred: 6715f349cd0bc5; Value: 10K 1%; Part Type: 贴片电阻
*#9 = radxa_1010: Page Create Date: March  8, 1995; Page Size: =PageSize; Page Modify Date: =ModifiedDate